# EAGLE schematic untitled (EAGLE 9.6.2)
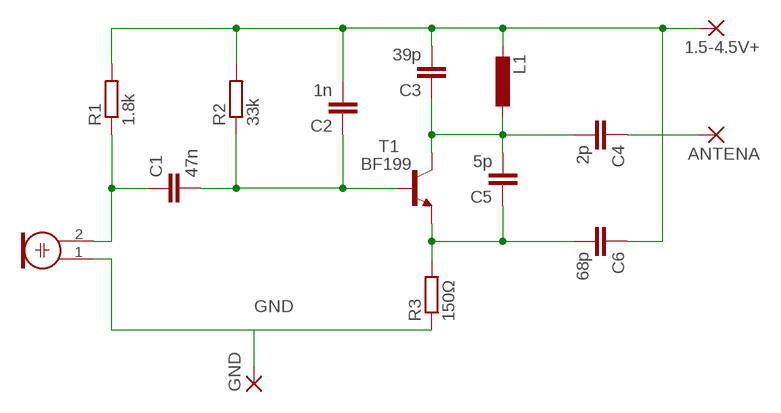
[diagram p0: schematic, sheet 1]

## Parts
1.5-4.5V+  3,81/1,4  [3,81/1,4]
ANTENA  3,81/1,4  [3,81/1,4]
C1  47n  C-EU025-025X050  [C025-025X050]
C2  1n  C-EU025-025X050  [C025-025X050]
C3  39p  C-EU025-025X050  [C025-025X050]
C4  2p  C-EU025-025X050  [C025-025X050]
C5  5p  C-EU025-025X050  [C025-025X050]
C6  68p  C-EU025-025X050  [C025-025X050]
GND  3,81/1,4  [3,81/1,4]
L1  L-EU0207/7  [0207/7]
M1  ELECTRET_MICROPHON-WM-61B  [WM-61B]
R1  1.8k  R-EU_0207/10  [0207/10]
R2  33k  R-EU_0207/10  [0207/10]
R3  150Ω  R-EU_0207/10  [0207/10]
T1  BF199  [TO92]

## Nets
GND: GND.1(P) M1.1 R3.1
N$2: C1.1 M1.2 R1.1
N$3: C1.2 C2.1 R2.1 T1.1(B)
N$5: C5.1 C6.2 R3.2 T1.2(E)
N$6: C3.1 C4.2 C5.2 L1.1 T1.3(C)
N$7: 1.5-4.5V+.1(P) C2.2 C3.2 C6.1 L1.2 R1.2 R2.2
N$8: ANTENA.1(P) C4.1

## Library data of the parts
1.5-4.5V+ ANTENA GND = wirepad:3,81/1,4: THROUGH-HOLE PAD
C1-C6 = rcl:C-EU: CAPACITOR, European symbol; SPICEPREFIX: C
L1 = rcl:L-EU: INDUCTOR, European symbol; SPICEPREFIX: L
M1 = microphon:ELECTRET_MICROPHON-: Electret Condenser Microphone
R1-R3 = rcl:R-EU_: RESISTOR, European symbol; SPICEPREFIX: R
T1 = transistor-npn:BF199*: NPN Transistor